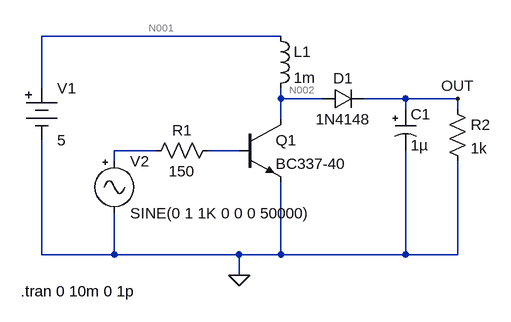
[diagram p0: schematic LABOEJ3.asc]
LABOEJ3.asc, the LTspice schematic file:
Version 4
SHEET 1 880 680
WIRE 208 -16 -160 -16
WIRE -160 64 -160 -16
WIRE 208 80 208 64
WIRE 272 80 208 80
WIRE 400 80 336 80
WIRE 480 80 400 80
WIRE 400 96 400 80
WIRE 480 96 480 80
WIRE 208 112 208 80
WIRE 16 160 -48 160
WIRE 144 160 96 160
WIRE -48 176 -48 160
WIRE -160 320 -160 144
WIRE -48 320 -48 256
WIRE -48 320 -160 320
WIRE 144 320 -48 320
WIRE 208 320 208 208
WIRE 208 320 144 320
WIRE 400 320 400 160
WIRE 400 320 208 320
WIRE 480 320 480 176
WIRE 480 320 400 320
WIRE 144 352 144 320
FLAG 144 352 0
FLAG 480 80 OUT
SYMBOL npn 144 112 R0
SYMATTR InstName Q1
SYMATTR Value BC337-40
SYMBOL res 112 144 R90
WINDOW 0 0 56 VBottom 2
WINDOW 3 32 56 VTop 2
SYMATTR InstName R1
SYMATTR Value 150
SYMBOL ind 192 -32 R0
SYMATTR InstName L1
SYMATTR Value 1m
SYMBOL diode 272 96 R270
WINDOW 0 32 32 VTop 2
WINDOW 3 0 32 VBottom 2
SYMATTR InstName D1
SYMATTR Value 1N4148
SYMBOL polcap 384 96 R0
SYMATTR InstName C1
SYMATTR Value 1µ
SYMBOL res 464 80 R0
SYMATTR InstName R2
SYMATTR Value 1k
SYMATTR SpiceLine pwr=5
SYMBOL Misc\\battery -160 48 R0
WINDOW 123 0 0 Left 0
WINDOW 39 0 0 Left 0
SYMATTR InstName V1
SYMATTR Value 5
SYMBOL Misc\\signal -48 160 R0
WINDOW 123 0 0 Left 0
WINDOW 39 0 0 Left 0
SYMATTR InstName V2
SYMATTR Value SINE(0 1 1K 0 0 0 50000)
TEXT -192 376 Left 2 !.tran 0 10m 0 1p

The netlist it stands for:
* LABOEJ3.asc
Q1 N002 N004 0 0 BC337-40
R1 N004 N003 150
L1 N001 N002 1m
D1 N002 OUT 1N4148
C1 OUT 0 1µ
R2 OUT 0 1k pwr=5
V1 N001 0 5
V2 N003 0 SINE(0 1 1K 0 0 0 50000)
.model D D
.lib standard.dio
.model NPN NPN
.model PNP PNP
.lib standard.bjt
.tran 0 10m 0 1p
.backanno
.end

* Results of the author's LTspice run, read from the files saved beside the schematic
* Operating Point, zero values left out:
*   V(n002) = 5 V
*   V(n001) = 5 V
*   V(out) = 4.347 V
*   Ic(Q1) = 5.151 pA
*   Ib(Q1) = -5.068 pA
*   I(D1) = 4.347 mA
*   I(L1) = 4.347 mA
*   I(R2) = 4.347 mA
*   I(R1) = 5.068 pA
*   I(V2) = 5.068 pA
*   I(V1) = -4.347 mA